# Altium project Power_Delivery.PrjPcb
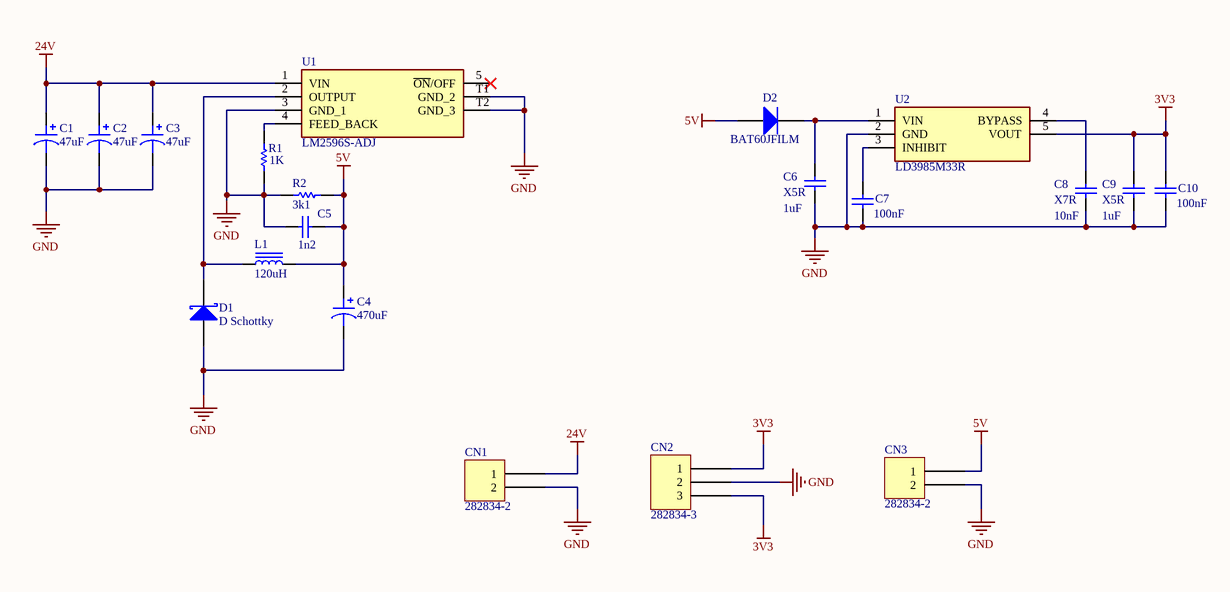
[diagram p0: Converters.SchDoc]
1 sheet, 20 parts. Net scope: global (net labels, ports and power ports of the same name join across sheets).
Board file: PCB.PcbDoc

## Sheet Converters.SchDoc
size B

### Parts
C1  47uF  [CAP ALSMD 6.6MM H6.1MM]
C2  47uF  [CAP ALSMD 6.6MM H6.1MM]
C3  47uF  [CAP ALSMD 6.6MM H6.1MM]
C4  470uF  [CAP ALSMD 6.6MM H6.1MM]
C5  value 1n2  [1608[0603]]  (hidden comment: X5R)
C6  X5R  value 1uF  [1608[0603]]
C7  value 100nF  [1608[0603]]  (hidden comment: X5R)
C8  X7R  value 10nF  [1608[0603]]
C9  X5R  value 1uF  [1608[0603]]
C10  value 100nF  [1608[0603]]  (hidden comment: X5R)
CN1  282834-2  [TE 282834-2]
CN2  282834-3  [TE 282834-3]
CN3  282834-2  [TE 282834-2]
D1  D Schottky  [C0805]
D2  BAT60JFILM  [C0805]
L1  120uH  [IND 0806_2016]
R1  value 1K  [1608[0603]]  (hidden comment: Res1)
R2  value 3k1  [1608[0603]]  (hidden comment: Res1)
U1  LM2596S-ADJ  [LM2596SXADJ]
U2  LD3985M33R  [SOT95P280X145-5N]

### Nets
3V3: C9.2 C10.1 CN2.1 CN2.3 U2.5(VOUT)
5V: C4.1 C5.2 CN3.1 D2.1(A) L1.2 R2.1
24V: C1.1 C2.1 C3.1 CN1.1 U1.1(VIN)
GND: C1.2 C2.2 C3.2 C4.2 C5.1 C6.1 C7.2 C8.1 C9.1 C10.2 CN1.2 CN2.2 CN3.2 D1.1(A) R1.1 R2.2 U1.3(GND_1) U1.T1(GND_2) U1.T2(GND_3) U2.2(GND)
NetC6_2: C6.2 D2.2(K) U2.1(VIN)
NetC7_1: C7.1 U2.3(INHIBIT)
NetC8_2: C8.2 U2.4(BYPASS)
NetD1_2: D1.2(K) L1.1 U1.2(OUTPUT)
NetR1_2: R1.2 U1.4(FEED_BACK)

Not connected (* = marked no-connect by the designer): U1 5(~{ON}/OFF)*

### Library data of the parts
C1-C4 = UUD1C680MCL1GS: CAP ALUM 68UF 20% 16V SMD; manufacturer: Nichicon; Capacitance: 68µF; Impedance: 440 mOhms; Lifetime @ Temp.: 2000 Hrs @ 105°C; Polarization: Polar; Ripple Current @ High Frequency: 230mA @ 100kHz; Ripple Current @ Low Frequency: 115mA @ 120Hz; Surface Mount Land Size: 0.260" L x 0.260" W (6.60mm x 6.60mm); value: 68µF; Part Number: UUD1C680MCL1GS; Applications: General Purpose; componentlink1description: Datasheet; componentlink1url: http://nichicon-us.com/english/products/pdfs/e-uud.pdf; componentlink2description: DigiKey Link; componentlink2url: http://digikey.com/product-detail/en/nichicon/UUD1C680MCL1GS/493-2261-1-ND/590236; Device Package: Radial, Can - SMD; Height - Seated (Max): 0.228" (5.80mm); lastupdated: 9/2/2020 1:18:40 AM; Lifecycle Status: Active; Minimum Order: 1; Mounting Type: Surface Mount; Operating Temperature: -55°C ~ 105°C; Package / Case: Radial, Can - SMD; packaging: TapeAndReel; partid: 9018; Part Status: Active; price: 0.11; series: UUD; Size / Dimension: 0.248" Dia (6.30mm); Supplier 1: DigiKey; Supplier Part Number 1: 493-2261-1-ND; Tolerance: ±20%; Voltage - Rated: 16V
C5-C10 = Cap: Capacitor; Published: 8-Jun-2000; LatestRevisionDate: 17-Jul-2002; LatestRevisionNote: Re-released for DXP Platform.; PackageReference: RAD-0.3; Publisher: Altium Limited; PackageDescription: Radial Cap, Thru-Hole; 2 Leads; 0.3 in Pin Spacing
CN1 CN3 = 282834-2: TERM BLK 2P SIDE ENT 2.54MM PCB; Manufacturer: TE Connectivity AMP Connectors; Current: 10A; Mating Orientation: Horizontal with Board; Number of Levels: 1; Pitch: 0.100" (2.54mm); Positions Per Level: 2; Voltage: 150V; Wire Gauge: 16-30 AWG; Wire Termination: Screw - Rising Cage Clamp; Part Number: 282834-2; Color: Green; ComponentLink1Description: Datasheet; ComponentLink1URL: https://www.te.com/commerce/DocumentDelivery/DDEController?Action=srchrtrv&DocNm=282834&DocType=Customer+Drawing&DocLang=English; ComponentLink2Description: DigiKey Link; ComponentLink2URL: http://digikey.com/product-detail/en/te-connectivity-amp-connectors/282834-2/A98333-ND/1150135; LastUpdated: 1/15/2020 4:15:38 AM; Lifecycle Status: Active; Minimum Order: 1; Mounting Type: Through Hole; Packaging: Bulk; Part Status: Active; Price: 0.88; Series: Buchanan; Supplier 1: DigiKey; Supplier Part Number 1: A98333-ND
CN2 = 282834-3: TERM BLK 3P SIDE ENT 2.54MM PCB; Manufacturer: TE Connectivity AMP Connectors; Current: 10A; Mating Orientation: Horizontal with Board; Number of Levels: 1; Pitch: 0.100" (2.54mm); Positions Per Level: 3; Voltage: 150V; Wire Gauge: 16-30 AWG; Wire Termination: Screw - Rising Cage Clamp; Part Number: 282834-3; Color: Green; ComponentLink1Description: Datasheet; ComponentLink1URL: https://www.te.com/commerce/DocumentDelivery/DDEController?Action=srchrtrv&DocNm=282834&DocType=Customer+Drawing&DocLang=English; ComponentLink2Description: DigiKey Link; ComponentLink2URL: http://digikey.com/product-detail/en/te-connectivity-amp-connectors/282834-3/A98334-ND/1153264; LastUpdated: 1/15/2020 4:15:50 AM; Lifecycle Status: Active; Minimum Order: 1; Mounting Type: Through Hole; Packaging: Bulk; Part Status: Active; Price: 2.01; Series: Buchanan; Supplier 1: DigiKey; Supplier Part Number 1: A98334-ND
D1 = D Schottky: Schottky Diode; Published: 8-Jun-2000; LatestRevisionDate: 17-Jul-2002; LatestRevisionNote: Re-released for DXP Platform.; PackageReference: SMB; Publisher: Altium Limited; PackageDescription: DO-214-AA/SMB; 2 C-Bend Leads; Body 5.3 x 3.6 mm, inc. leads (LxW); Code_JEDEC: DO-214-AA
D2 = Diode: Default Diode; Published: 8-Jun-2000; LatestRevisionDate: 17-Jul-2002; LatestRevisionNote: Re-released for DXP Platform.; PackageVersion: Sep-1996; PackageReference: SMC; Publisher: Altium Limited; PackageDescription: DO-214-AB/SMC; 2 C-Bend Leads; Body 7.9 x 5.9 mm, inc. leads (LxW); Code_JEDEC: DO-214-AB
L1 = SDED20161T-100MS: FIXED IND 10UH 470MA 1.119OHM SM; Manufacturer: Delta Electronics/Cyntec; Current - Saturation: 550mA; DC Resistance (DCR): 1.119Ohm Max; Inductance: 10 µH; Inductance Frequency - Test: 1 MHz; Material - Core: 0806 (2016 Metric); Shielding: Shielded; Tolerance: ±20%; Value: 10 µH; Part Number: SDED20161T-100MS; ComponentLink1Description: Datasheet; ComponentLink1URL: http://www.cyntec.com/upfile/products/download/SDED20161T-000%20(A6).pdf; ComponentLink2Description: DigiKey Link; ComponentLink2URL: https://www.digikey.com/en/products/detail/delta-electronics-cyntec/SDED20161T-100MS/9761144; Current Rating (Amps): 470 mA; Device Package: 0806 (2016 Metric); Height - Seated (Max): 0.039" (1.00mm); LastUpdated: 2/4/2023 8:56:44 PM; Lifecycle Status: Active; Minimum Order: 1; Mounting Type: Surface Mount; Operating Temperature: -55°C ~ 125°C; Package / Case: 0806 (2016 Metric); Packaging: TapeAndReel; PartId: 2783; Part Status: Active; Price: 0.08; Series: SDED20161T; Size / Dimension: 0.079" L x 0.063" W (2.00mm x 1.60mm); Supplier 1: DigiKey; Supplier Part Number 1: 2037-SDED20161T-100MSCT-ND; Supplier Device Package: 0806
R1 R2 = Res1: Resistor; Published: 8-Jun-2000; LatestRevisionDate: 17-Jul-2002; LatestRevisionNote: Re-released for DXP Platform.; PackageReference: AXIAL-0.3; Publisher: Altium Limited; PackageDescription: Axial Device, Thru-Hole; 2 Leads; 0.3 in Pin Spacing
U1 = LM2596S-ADJ: Integrated Circuit; Manufacturer_Name: Texas Instruments; Datasheet Link: https://www.ti.com/lit/ds/symlink/lm2596.pdf?HQS=ti-null-null-sf-df-pf-sep-wwe&ts=1592978195629; Height: 4.57mm; Manufacturer_Part_Number: LM2596S-ADJ; Mouser Part Number: 926-LM2596S-ADJ; Mouser Price/Stock: https://www.mouser.co.uk/ProductDetail/Texas-Instruments/LM2596S-ADJ?qs=X1J7HmVL2ZGmRmhAtwKZ2Q%3D%3D
U2 = LD3985M33R: Integrated Circuit; Manufacturer_Name: STMicroelectronics; Datasheet Link: http://www.st.com/st-web-ui/static/active/en/resource/technical/document/datasheet/CD00003395.pdf; Height: 1.45mm; Manufacturer_Part_Number: LD3985M33R; Mouser Part Number: 511-LD3985M33R; Mouser Price/Stock: https://www.mouser.co.uk/ProductDetail/STMicroelectronics/LD3985M33R?qs=22WmWNTp1rrPOccVv4HZ7A%3D%3D; Arrow Part Number: LD3985M33R; Arrow Price/Stock: https://www.arrow.com/en/products/ld3985m33r/stmicroelectronics?region=nac